# EAGLE design Voicecard-SVF-v04 (EAGLE 5.09)
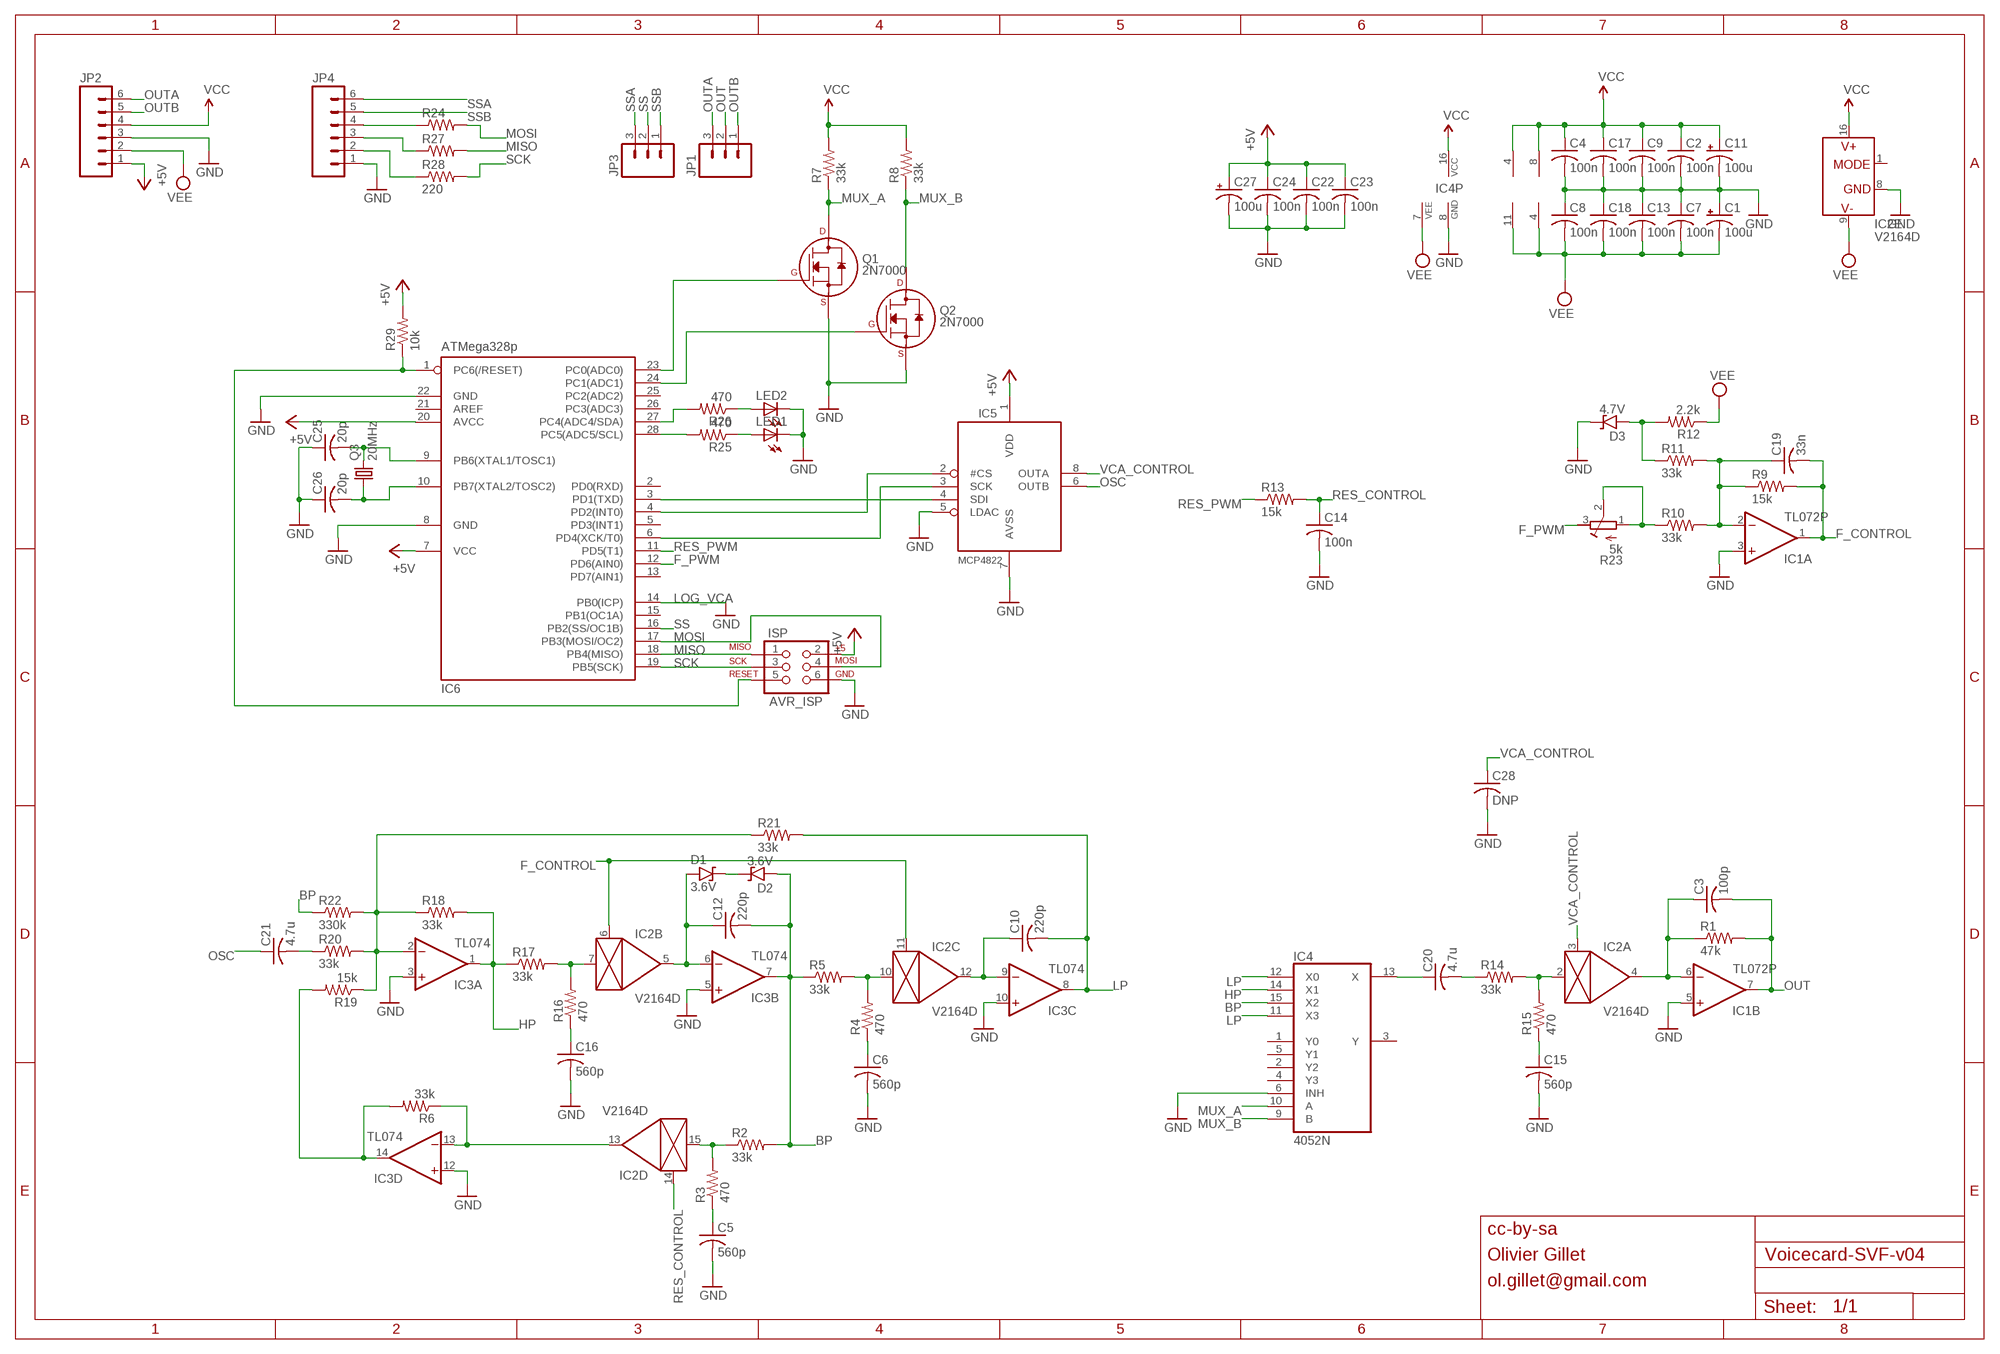
[diagram p0: schematic, sheet 1]

## Parts
C1  100u  CPOL-USE2.5-6  [E2,5-6]
C2  100n  C-US025-025X050  [C025-025X050]
C3  100p  C-US025-025X050  [C025-025X050]
C4  100n  C-US025-025X050  [C025-025X050]
C5  560p  C-US025-025X050  [C025-025X050]
C6  560p  C-US025-025X050  [C025-025X050]
C7  100n  C-US025-025X050  [C025-025X050]
C8  100n  C-US025-025X050  [C025-025X050]
C9  100n  C-US025-025X050  [C025-025X050]
C10  220p  C-US025-025X050  [C025-025X050]
C11  100u  CPOL-USE2.5-6  [E2,5-6]
C12  220p  C-US025-025X050  [C025-025X050]
C13  100n  C-US025-025X050  [C025-025X050]
C14  100n  C-US025-025X050  [C025-025X050]
C15  560p  C-US025-025X050  [C025-025X050]
C16  560p  C-US025-025X050  [C025-025X050]
C17  100n  C-US025-025X050  [C025-025X050]
C18  100n  C-US025-025X050  [C025-025X050]
C19  33n  C-US050-025X075  [C050-025X075]
C20  4.7u  C-US  [ENP11-6.3]
C21  4.7u  C-US  [ENP11-6.3]
C22  100n  C-US025-025X050  [C025-025X050]
C23  100n  C-US025-025X050  [C025-025X050]
C24  100n  C-US025-024X044  [C025-024X044]
C25  20p  C-US025-024X044  [C025-024X044]
C26  20p  C-US025-024X044  [C025-024X044]
C27  100u  CPOL-USE2.5-6  [E2,5-6]
C28  DNP  C-US025-025X050  [C025-025X050]
D1  3.6V  1N47XXDO35  [D-5]
D2  3.6V  1N47XXDO35  [D-5]
D3  4.7V  1N47XXDO35  [D-5]
IC1  TL072P  [DIL08]
IC2  V2164D  SSM2164P  [DIL16]
IC3  TL074  TL084P  [DIL14]
IC4  4052N  [DIL16]
IC5  MCP4822  [DIL08]
IC6  ATMega328p  MEGA8-P  [DIL28-3]
ISP  AVR_ISP  AVR_SPI_PRG_6PTH  [2X3]
JP1  M03PTH  [1X03]
JP2  M06SIP  [1X06]
JP3  M03PTH  [1X03]
JP4  M06SIP  [1X06]
LED1  LED3MM  [LED3MM]
LED2  LED3MM  [LED3MM]
Q1  2N7000  [TO-92]
Q2  2N7000  [TO-92]
Q3  20MHz  CRYSTALHC49U-V  [HC49U-V]
R1  47k  R-US_0204/7  [0204/7]
R2  33k  R-US_0204/7  [0204/7]
R3  470  R-US_0204/7  [0204/7]
R4  470  R-US_0204/7  [0204/7]
R5  33k  R-US_0204/7  [0204/7]
R6  33k  R-US_0204/7  [0204/7]
R7  33k  R-US_0204/7  [0204/7]
R8  33k  R-US_0204/7  [0204/7]
R9  15k  R-US_0204/7  [0204/7]
R10  33k  R-US_0204/7  [0204/7]
R11  33k  R-US_0204/7  [0204/7]
R12  2.2k  R-US_0204/7  [0204/7]
R13  15k  R-US_0204/7  [0204/7]
R14  33k  R-US_0204/7  [0204/7]
R15  470  R-US_0204/7  [0204/7]
R16  470  R-US_0204/7  [0204/7]
R17  33k  R-US_0204/7  [0204/7]
R18  33k  R-US_0204/7  [0204/7]
R19  15k  R-US_0204/7  [0204/7]
R20  33k  R-US_0204/7  [0204/7]
R21  33k  R-US_0204/7  [0204/7]
R22  330k  R-US_0204/7  [0204/7]
R23  5k  R-TRIMM3296P  [RTRIM3296P]
R24  220  R-US_0204/7  [0204/7]
R25  470  R-US_0204/7  [0204/7]
R26  470  R-US_0204/7  [0204/7]
R27  220  R-US_0204/7  [0204/7]
R28  220  R-US_0204/7  [0204/7]
R29  10k  R-US_0204/7  [0204/7]

## Nets
+5V: C22.1 C23.1 C24.1 C27.+ IC5.1(VDD) IC6.7(VCC) IC6.20(AVCC) ISP.2 JP2.1 R29.2
BP: C12.2 D2.A IC3.7(B:OUT) IC4.15(X2) R2.2 R5.1 R22.1
F_CONTROL: C19.2 IC1.1(A:OUT) IC2.6(B:CTRL) IC2.11(C:CTRL) R9.2
F_PWM: IC6.12(PD6(AIN0)) R23.3(A)
FILTER_MIX1: C20.+ IC4.13(X)
GND: C1.+ C2.2 C4.2 C5.2 C6.2 C7.1 C8.1 C9.2 C11.- C13.1 C14.2 C15.2 C16.2 C17.2 C18.1 C22.2 C23.2 C24.2 C25.1 C26.1 C27.- C28.2 D3.C IC1.3(A:+IN) IC1.5(B:+IN) IC2.8(E:GND) IC3.3(A:+IN) IC3.5(B:+IN) IC3.10(C:+IN) IC3.12(D:+IN) IC4.6(INH) IC4.8(GND) IC5.5(LDAC) IC5.7(AVSS) IC6.8(GND) IC6.14(PB0(ICP)) IC6.22(GND) ISP.6 JP2.3 JP4.1 LED1.K(C) LED2.K(C) Q1.1(S) Q2.1(S)
HP: IC3.1(A:OUT) IC4.14(X1) R17.1 R18.2
LEDS0: IC6.28(PC5(ADC5/SCL)) R25.2
LP: C10.2 IC3.8(C:OUT) IC4.11(X3) IC4.12(X0) R21.2
MISO: IC6.18(PB4(MISO)) ISP.1 R27.2
MOSI: IC6.17(PB3(MOSI/OC2)) ISP.4 R24.2
MUX_A: IC4.10(A) Q1.3(D) R7.1
MUX_B: IC4.9(B) Q2.3(D) R8.1
N$1: C21.- R20.1
N$3: IC5.4(SDI) IC6.3(PD1(TXD))
N$4: IC6.23(PC0(ADC0)) Q1.2(G)
N$5: C20.- R14.1
N$6: IC6.24(PC1(ADC1)) Q2.2(G)
N$7: LED1.A R25.1
N$8: JP4.2 R28.1
N$9: D3.A R11.1 R12.2
N$10: LED2.A R26.1
N$11: IC6.27(PC4(ADC4/SDA)) R26.2
N$12: IC3.2(A:-IN) R18.1 R19.1 R20.2 R21.1 R22.2
N$13: JP4.3 R27.1
N$14: IC6.1(PC6(/RESET)) ISP.5 R29.1
N$15: IC5.3(SCK) IC6.6(PD4(XCK/T0))
N$16: IC5.2(#CS) IC6.4(PD2(INT0))
N$17: C6.1 R4.1
N$18: JP4.4 R24.1
N$19: C12.1 D1.A IC2.5(B:OUT) IC3.6(B:-IN)
N$21: IC2.15(D:IN) R2.1 R3.2
N$26: IC2.10(C:IN) R4.2 R5.2
N$27: C5.1 R3.1
N$28: C10.1 IC2.12(C:OUT) IC3.9(C:-IN)
N$29: IC2.7(B:IN) R16.2 R17.2
N$30: C16.1 R16.1
N$31: IC2.13(D:OUT) IC3.13(D:-IN) R6.1
N$40: C19.1 IC1.2(A:-IN) R9.1 R10.2 R11.2
N$41: R10.1 R23.1(E) R23.2(S)
N$48: IC3.14(D:OUT) R6.2 R19.2
N$55: D1.C D2.C
N$65: C15.1 R15.1
N$67: IC2.2(A:IN) R14.2 R15.2
N$77: C3.1 IC1.6(B:-IN) IC2.4(A:OUT) R1.1
N$82: C26.2 IC6.10(PB7(XTAL2/TOSC2)) Q3.1
N$83: C25.2 IC6.9(PB6(XTAL1/TOSC1)) Q3.2
OSC: C21.+ IC5.6(OUTB)
OUT: C3.2 IC1.7(B:OUT) JP1.2 R1.2
OUTA: JP1.3 JP2.6
OUTB: JP1.1 JP2.5
RES_CONTROL: C14.1 IC2.14(D:CTRL) R13.2
RES_PWM: IC6.11(PD5(T1)) R13.1
SCK: IC6.19(PB5(SCK)) ISP.3 R28.2
SS: IC6.16(PB2(SS/OC1B)) JP3.2
SSA: JP3.3 JP4.6
SSB: JP3.1 JP4.5
VCA_CONTROL: C28.1 IC2.3(A:CTRL) IC5.8(OUTA)
VCC: C2.1 C4.1 C9.1 C11.+ C17.1 IC1.8(P:V+) IC2.16(E:V+) IC3.4(P:V+) IC4.16(VCC) JP2.4 R7.2 R8.2
VEE: C1.- C7.2 C8.2 C13.2 C18.2 IC1.4(P:V-) IC2.9(E:V-) IC3.11(P:V-) IC4.7(VEE) JP2.2 R12.1
Unconnected: IC2.1(E:MODE) IC4.1(Y0) IC4.2(Y2) IC4.3(Y) IC4.4(Y3) IC4.5(Y1) IC6.2(PD0(RXD)) IC6.5(PD3(INT1)) IC6.13(PD7(AIN1)) IC6.15(PB1(OC1A)) IC6.21(AREF) IC6.25(PC2(ADC2)) IC6.26(PC3(ADC3))

## Notes on the sheet
- LOG_VCA
- cc-by-sa
- Olivier Gillet
- ol.gillet@gmail.com

## Library data of the parts
C1 C11 C27 = rcl:CPOL-US: POLARIZED CAPACITOR, American symbol
C2-C10 C12-C19 C22-C26 C28 = rcl:C-US: CAPACITOR, American symbol
C20 C21 = og-rcl:C-US
D1-D3 = og-diodes:1N47XX: Zener Diode 1N4728 - 1N4764: 3.3 V - 100V, 10% (1n47xxA 5%); DO-41 glass case
IC1 = linear:TL072: OP AMP
IC2 = ssm2164:SSM2164
IC3 = linear:TL084: OP AMP
IC4 = 40xx:4052: Dual 4-channel ANALOG MULTIPLEXER
IC5 = og-dac:MCP4822
IC6 = atmel:MEGA8-P: MICROCONTROLLER 8 Kbytes FLASH, 1 kbytes SRAM, 512 bytes EEPROM, USART, 4-channel 10 bit ADC, 2-channel 8 bit ADC Pin compatible with Atmega48, ATMega88, ATMega168 Source: avr.lbr
ISP = SparkFun:AVR_SPI_PRG_6: AVR ISP 6 Pin This is the reduced ISP connector for AVR programming. Common on Arduino. This footprint will take up less PCB space and can be used with a 10-pin to 6-pin adapter such as SKU: BOB-08508
JP1 JP3 = SparkFun:M03: Header 3 Standard 3-pin 0.1" header. Use with straight break away headers (SKU : PRT-00116), right angle break away headers (PRT-00553), swiss pins (PRT-00743), machine pins (PRT-00117), and female headers (PRT-00115). Molex polarized connector foot print use with SKU : PRT-08232 with associated crimp pins and housings.
JP2 JP4 = SparkFun:M06: Header 6 Standard 6-pin 0.1" header. Use with straight break away headers (SKU : PRT-00116), right angle break away headers (PRT-00553), swiss pins (PRT-00743), machine pins (PRT-00117), and female headers (PRT-00115). Molex polarized connector foot print use with SKU : PRT-08094 with associated crimp pins and housings. NOTES ON THE VARIANTS LOCK and LOCK_LONGPADS... This footprint was designed to help hold the alignment of a through-hole component (i.e. 6-pin header) while soldering it into place. You may notice that each hole has been shifted either up or down by 0.005 of an inch from it's more standard position (which is a perfectly straight line). This slight alteration caused the pins (the squares in the middle) to touch the edges of the holes. Because they are alternating, it causes a "brace" to hold the component in place. 0.005 has proven to be the perfect amount of "off-center" position when using our standard breakaway headers. Although looks a little odd when you look at the bare footprint, once you have a header in there, the alteration is very hard to notice. Also, if you push a header all the way into place, it is covered up entirely on the bottom side. This idea of altering the position of holes to aid alignment will be further integrated into the Sparkfun Library for other footprints. It can help hold any component with 3 or more connection pins.
LED1 LED2 = led:LED: LED OSRAM: - CHIPLED LG R971, LG N971, LY N971, LG Q971, LY Q971, LO R971, LY R971 LH N974, LH R974 LS Q976, LO Q976, LY Q976 LO Q996 - Hyper CHIPLED LW Q18S LB Q993, LB Q99A, LB R99A - SideLED LS A670, LO A670, LY A670, LG A670, LP A670 LB A673, LV A673, LT A673, LW A673 LH A674 LY A675 LS A676, LA A676, LO A676, LY A676, LW A676 LS A679, LY A679, LG A679 - Hyper Micro SIDELED® LS Y876, LA Y876, LO Y876, LY Y876 LT Y87S - SmartLED LW L88C, LW L88S LB L89C, LB L89S, LG L890 LS L89K, LO L89K, LY L89K LS L896, LA L896, LO L896, LY L896 - TOPLED LS T670, LO T670, LY T670, LG T670, LP T670 LSG T670, LSP T670, LSY T670, LOP T670, LYG T670 LG T671, LOG T671, LSG T671 LB T673, LV T673, LT T673, LW T673 LH T674 LS T676, LA T676, LO T676, LY T676, LB T676, LH T676, LSB T676, LW T676 LB T67C, LV T67C, LT T67C, LS T67K, LO T67K, LY T67K, LW E67C LS E67B, LA E67B, LO E67B, LY E67B, LB E67C, LV E67C, LT E67C LW T67C LS T679, LY T679, LG T679 LS T770, LO T770, LY T770, LG T770, LP T770 LB T773, LV T773, LT T773, LW T773 LH T774 LS E675, LA E675, LY E675, LS T675 LS T776, LA T776, LO T776, LY T776, LB T776 LHGB T686 LT T68C, LB T68C - Hyper Mini TOPLED® LB M676 - Mini TOPLED Santana® LG M470 LS M47K, LO M47K, LY M47K Source: http://www.osram.convergy.de LUXEON: - LUMILED® LXK2-PW12-R00, LXK2-PW12-S00, LXK2-PW14-U00, LXK2-PW14-V00 LXK2-PM12-R00, LXK2-PM12-S00, LXK2-PM14-U00 LXK2-PE12-Q00, LXK2-PE12-R00, LXK2-PE12-S00, LXK2-PE14-T00, LXK2-PE14-U00 LXK2-PB12-K00, LXK2-PB12-L00, LXK2-PB12-M00, LXK2-PB14-N00, LXK2-PB14-P00, LXK2-PB14-Q00 LXK2-PR12-L00, LXK2-PR12-M00, LXK2-PR14-Q00, LXK2-PR14-R00 LXK2-PD12-Q00, LXK2-PD12-R00, LXK2-PD12-S00 LXK2-PH12-R00, LXK2-PH12-S00 LXK2-PL12-P00, LXK2-PL12-Q00, LXK2-PL12-R00 Source: www.luxeon.com KINGBRIGHT: KA-3528ASYC Source: www.kingbright.com
Q1 Q2 = og-transistors:2N7000: N-channel MOSFET
Q3 = crystal:CRYSTAL: CRYSTAL
R1-R22 R24-R29 = rcl:R-US_: RESISTOR, American symbol
R23 = rcl:R-TRIMM: Trimm resistor

## Board
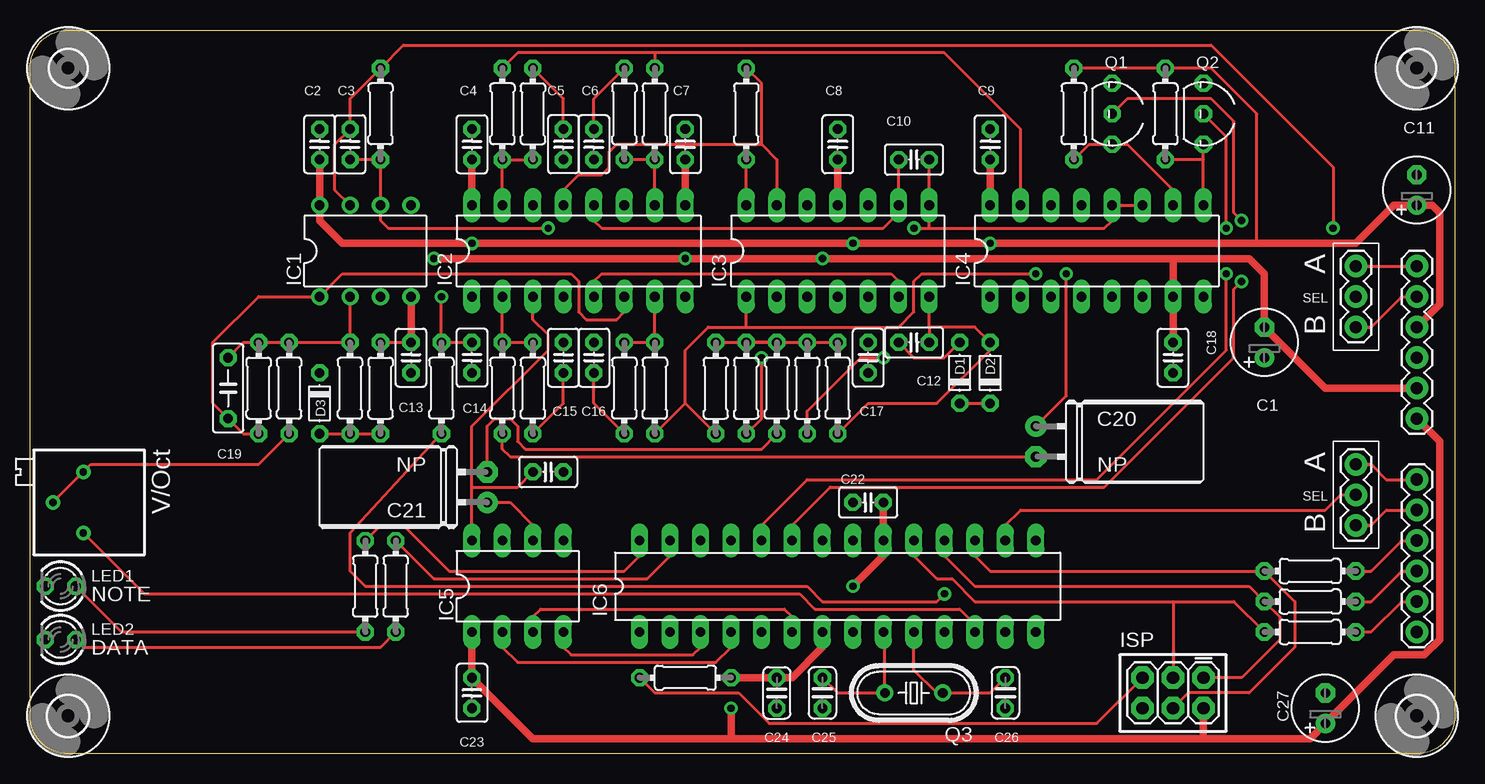
[diagram p1: board, top side]
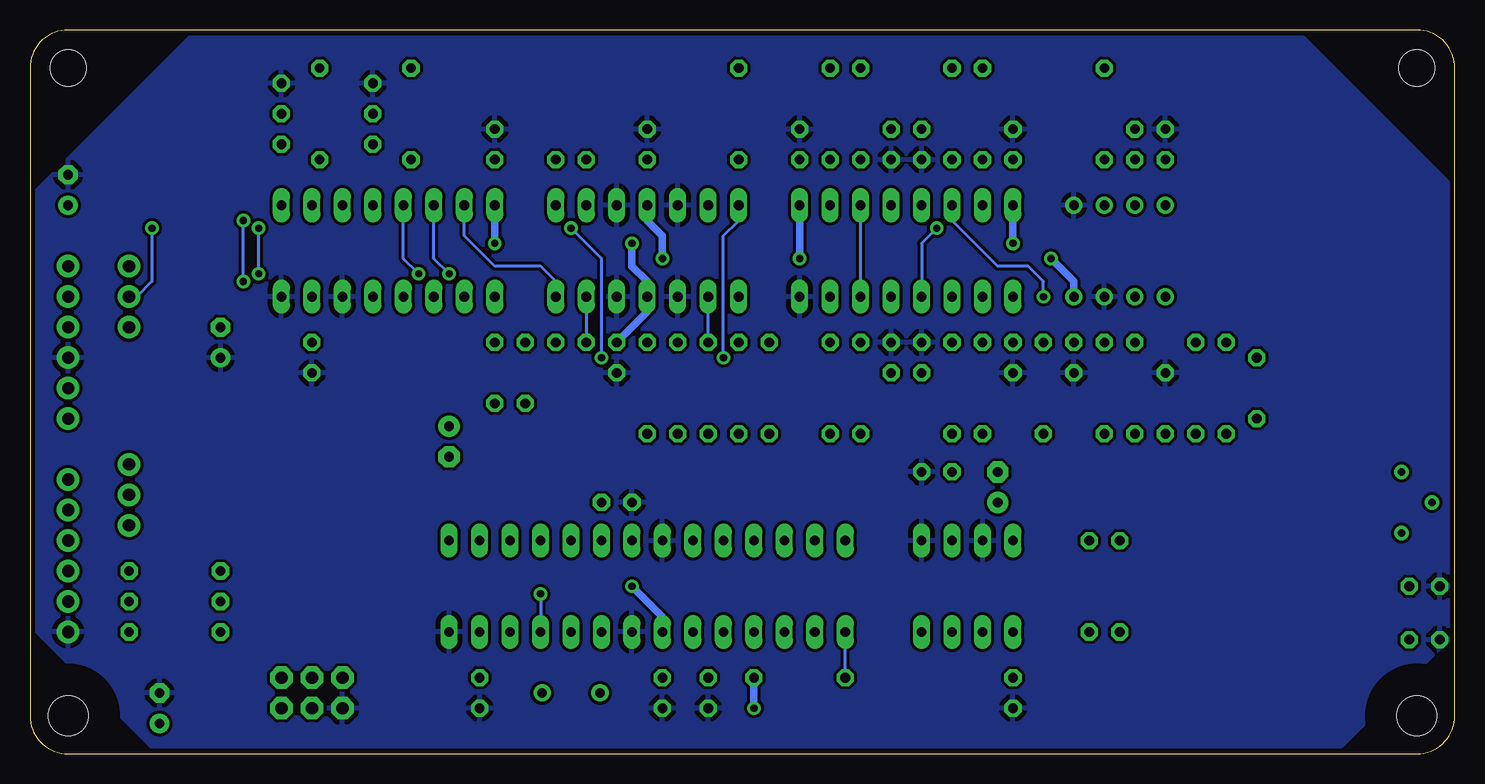
[diagram p2: board, bottom side, seen from below]

Size 118.75 x 60.33 mm. Coordinates in mm from the lower left corner, seen from the top.
Outline: 0,57.15 arc-90 3.17,60.33 115.57,60.33 arc-90 118.75,57.15 118.75,3.17 arc-90 115.57,0 3.17,0 arc-90 0,3.17 0,57.15
Copper layers (1*16): Top 0.035mm / dielectric 1.5mm / Bottom 0.035mm
Design rules "SparkFun *": minimum track width 8mil, minimum drill 20mil, track to track 8mil, track to pad 8mil, pad to pad 8mil, via to via 8mil, smd to smd 8mil, copper to edge 10mil, drill to drill 8mil, minimum pad ring 12mil, minimum via ring 10mil, stop-mask expansion 4mil, vias tented up to drill 25mil, thermal gap 16mil

### Footprints (pad centres in the part's own frame; a part is rotated, then mirrored left to right if it is on the bottom)
E2,5-6 = drill 0.813 pad 1.6 round: + -1.27,0 | drill 0.813 pad 1.6 octagon: - 1.27,0
C025-025X050 = drill 0.813 octagon: 1 -1.27,0; 2 1.27,0
C050-025X075 = drill 0.813 octagon: 1 -2.54,0; 2 2.54,0
ENP11-6.3 = drill 0.813 pad 1.778 round: + -2.54,1.27 | drill 0.813 pad 1.778 octagon: - -2.54,-1.27
C025-024X044 = drill 0.813 octagon: 1 -1.27,0; 2 1.27,0
D-5 = drill 0.813 octagon: A 2.54,0; C -2.54,0
DIL08 = drill 0.813 pad 1.27 round: 1 -3.81,-3.81; 2 -1.27,-3.81; 3 1.27,-3.81; 4 3.81,-3.81; 5 3.81,3.81; 6 1.27,3.81; 7 -1.27,3.81; 8 -3.81,3.81
DIL16 = drill 0.813 long: 1 -8.89,-3.81; 2 -6.35,-3.81; 3 -3.81,-3.81; 4 -1.27,-3.81; 5 1.27,-3.81; 6 3.81,-3.81; 7 6.35,-3.81; 8 8.89,-3.81; 9 8.89,3.81; 10 6.35,3.81; 11 3.81,3.81; 12 1.27,3.81; 13 -1.27,3.81; 14 -3.81,3.81; 15 -6.35,3.81; 16 -8.89,3.81
DIL14 = drill 0.813 long: 1 -7.62,-3.81; 2 -5.08,-3.81; 3 -2.54,-3.81; 4 0,-3.81; 5 2.54,-3.81; 6 5.08,-3.81; 7 7.62,-3.81; 8 7.62,3.81; 9 5.08,3.81; 10 2.54,3.81; 11 0,3.81; 12 -2.54,3.81; 13 -5.08,3.81; 14 -7.62,3.81
DIL08' = drill 0.813 long: 1 -3.81,-3.81; 2 -1.27,-3.81; 3 1.27,-3.81; 4 3.81,-3.81; 5 3.81,3.81; 6 1.27,3.81; 7 -1.27,3.81; 8 -3.81,3.81
DIL28-3 = drill 0.813 long: 1 -16.51,-3.81; 2 -13.97,-3.81; 3 -11.43,-3.81; 4 -8.89,-3.81; 5 -6.35,-3.81; 6 -3.81,-3.81; 7 -1.27,-3.81; 8 1.27,-3.81; 9 3.81,-3.81; 10 6.35,-3.81; 11 8.89,-3.81; 12 11.43,-3.81; 13 13.97,-3.81; 14 16.51,-3.81; 15 16.51,3.81; 16 13.97,3.81; 17 11.43,3.81; 18 8.89,3.81; 19 6.35,3.81; 20 3.81,3.81; 21 1.27,3.81; 22 -1.27,3.81; 23 -3.81,3.81; 24 -6.35,3.81; 25 -8.89,3.81; 26 -11.43,3.81; 27 -13.97,3.81; 28 -16.51,3.81
2X3 = drill 1.016 pad 1.88 octagon: 1 0,0; 2 0,2.54; 3 2.54,0; 4 2.54,2.54; 5 5.08,0; 6 5.08,2.54
1X03 = drill 1.016 pad 1.88 round: 1 0,0; 2 2.54,0; 3 5.08,0
1X06 = drill 1.016 pad 1.88 round: 1 0,0; 2 2.54,0; 3 5.08,0; 4 7.62,0; 5 10.16,0; 6 12.7,0
LED3MM = drill 0.813 octagon: A -1.27,0; K 1.27,0
TO-92 = drill 0.813 octagon: 1 -2.54,0; 2 0,0; 3 2.54,0
HC49U-V = drill 0.813 round: 1 -2.413,0; 2 2.413,0
0204/7 = drill 0.813 octagon: 1 -3.81,0; 2 3.81,0
RTRIM3296P = drill 0.61 round: 1 0,-2.54; 2 2.54,0; 3 0,2.54
3,0 = hole 3: 0,0
3,3 = hole 3.3: 0,0

### Placement (x,y rotation side)
C1  102.87,34.29 90 top
C2  24.13,50.8 90 top
C3  26.67,50.8 90 top
C4  36.83,50.8 90 top
C5  44.45,50.8 270 top
C6  46.99,50.8 270 top
C7  54.61,50.8 270 top
C8  67.31,50.8 270 top
C9  80.01,50.8 90 top
C10  73.66,49.53 0 top
C11  115.57,46.99 90 top
C12  73.66,34.29 0 top
C13  31.75,33.02 90 top
C14  36.83,33.02 270 top
C15  44.45,33.02 90 top
C16  46.99,33.02 90 top
C17  69.85,33.02 270 top
C18  95.25,33.02 90 top
C19  16.51,30.48 270 top
C20  86.36,26.04 0 top
C21  35.56,22.22 180 top
C22  69.85,20.95 180 top
C23  36.83,5.08 270 top
C24  62.23,5.08 270 top
C25  66.04,5.08 90 top
C26  81.28,5.08 90 top
C27  107.95,3.81 90 top
C28  43.18,23.5 0 top
D1  77.47,31.75 90 top
D2  80.01,31.75 90 top
D3  24.13,29.21 270 top
IC1  27.94,41.91 0 top
IC2  45.72,41.91 0 top
IC3  67.31,41.91 0 top
IC4  88.9,41.91 0 top
IC5  MCP4822  [DIL08']  40.64,13.97 0 top
IC6  67.31,13.97 0 top
ISP  97.79,6.35 180 top
JP1  110.49,35.56 90 top
JP2  115.57,27.94 90 top
JP3  110.49,19.05 90 top
JP4  115.57,10.16 90 top
LED1  2.54,13.97 180 top
LED2  2.54,9.53 180 top
Q1  90.17,53.34 270 top
Q2  97.79,53.34 270 top
Q3  73.66,5.08 180 top
R1  29.21,53.34 90 top
R2  39.37,53.34 90 top
R3  41.91,53.34 270 top
R4  49.53,53.34 270 top
R5  52.07,53.34 270 top
R6  59.69,53.34 270 top
R7  87,53.34 90 top
R8  94.61,53.34 90 top
R9  19.05,30.48 270 top
R10  21.59,30.48 90 top
R11  26.67,30.48 90 top
R12  29.21,30.48 270 top
R13  34.29,30.48 90 top
R14  39.37,30.48 90 top
R15  41.91,30.48 90 top
R16  49.53,30.48 90 top
R17  52.07,30.48 90 top
R18  57.15,30.48 270 top
R19  59.69,30.48 270 top
R20  62.23,30.48 90 top
R21  64.77,30.48 270 top
R22  67.31,30.48 90 top
R23  4.45,20.95 180 top
R24  106.68,15.24 180 top
R25  27.94,13.97 90 top
R26  30.48,13.97 90 top
R27  106.68,12.7 180 top
R28  106.68,10.16 180 top
R29  54.61,6.35 0 top
U$1  [3,0]  3.17,57.15 0 top
U$2  [3,0]  115.57,57.15 0 top
U$3  [LAPINO_LARGE]  3.17,28.57 0 top
U$4  [SARASWATI]  10.16,6.35 0 top
U$5  [3,3]  3.17,3.17 0 top
U$6  [3,3]  115.57,3.17 0 top

### Tracks (layer width: path | path; a pad name or v marks a point on that pad's centre or on a via)
+5V  (via drill 0.6)
  Top 0.61: v68.58,13.97 71.12,16.51 IC6.20 C22.1 | 58.42,1.27 41.91,1.27 C23.1 IC5.1 | 58.42,1.27 97.79,1.27 | 97.79,1.27 106.68,1.27 C27.+ 113.67,8.26 116.2,8.26 117.47,9.53 117.47,26.04 JP2.1 | R29.2 C24.1 63.5,6.35 66.04,8.89 IC6.7 | 58.42,1.27 v58.42,3.81 | 97.79,1.27 ISP.2
  Bottom 0.61: v68.58,13.97 66.04,11.43 IC6.7 | v58.42,3.81 R29.2
BP
  Top 0.254: R2.2 40.64,58.42 52.07,58.42 | 74.93,35.56 IC3.7 | 74.93,35.56 C12.2 | 52.07,58.42 76.2,58.42 82.55,52.07 IC4.15 | 52.07,58.42 R5.1 | 74.93,35.56 78.74,35.56 D2.A 80.01,33.66 75.56,29.21 69.85,29.21 R22.1
  Bottom 0.254: IC4.15 82.55,43.18 80.01,40.64 76.2,40.64 74.93,39.37 IC3.7
F_CONTROL
  Top 0.254: R9.2 17.78,26.67 C19.2 15.24,29.21 15.24,34.29 19.05,38.1 IC1.1 26.04,40.01 45.09,40.01 45.72,39.37 45.72,36.83 46.35,36.2 48.9,36.2 49.53,36.83 IC2.6
  Bottom 0.254: IC2.6 IC2.11
F_PWM
  Top 0.254: IC6.12 78.74,10.79 77.47,12.06 65.41,12.06 64.14,13.33 9.53,13.33 R23.3
FILTER_MIX1  (via drill 0.6)
  Top 0.254: C20.+ 86.36,29.84 v86.36,40.01
  Bottom 0.254: v86.36,40.01 87.63,41.28 IC4.13
GND
  pour Bottom (isolate 0.254): 0.64,47.62 0.64,9.53 9.53,0.64 108.58,0.64 118.11,10.16 118.11,46.99 105.41,59.69 12.7,59.69
HP  (via drill 0.6)
  Top 0.254: v83.82,40.01 74.3,40.01 73.66,39.37 73.66,36.83 72.39,35.56 59.69,35.56 | R17.1 54.61,29.21 | 54.61,29.21 R18.2 | 59.69,35.56 IC3.1 | 59.69,35.56 56.52,35.56 54.61,33.66 54.61,29.21
  Bottom 0.254: v83.82,40.01 85.09,41.28 IC4.14
LEDS0
  Top 0.254: R25.2 29.21,19.05 31.11,19.05 34.92,15.24 49.53,15.24 50.8,16.51 IC6.28
LP  (via drill 0.6)
  Top 0.254: C10.2 IC3.8 74.93,43.82 | v73.66,43.82 74.93,43.82 | 74.93,43.82 89.53,43.82 90.17,44.45 IC4.12 IC4.11 | R21.2 64.77,28.57 69.22,33.02 v71.12,33.02
  Bottom 0.254: v71.12,33.02 71.12,41.28 v73.66,43.82
MISO
  Top 0.254: IC6.18 76.2,16.51 78.74,13.97 101.6,13.97 R27.2 104.14,11.43 104.14,9.53 100.97,6.35 ISP.1
MOSI
  Top 0.254: IC6.17 78.74,16.51 80.01,15.24 R24.2 105.41,12.7 105.41,8.89 101.6,5.08 96.52,5.08 ISP.4
MUX_A
  Top 0.254: IC4.10 95.25,46.99 91.44,50.8 Q1.3 88.27,50.8 R7.1
MUX_B
  Top 0.254: IC4.9 97.79,49.53 | 97.79,49.53 Q2.3 | 97.79,49.53 R8.1
N$1
  Top 0.254: R20.1 60.96,25.4 41.27,25.4 40.64,26.04 40.64,27.3 40.01,27.94 38.73,27.94 38.1,27.3 C21.-
N$3
  Top 0.254: IC6.3 55.88,8.89 55.24,8.26 45.09,8.26 44.45,8.89 IC5.4
N$4  (via drill 0.6)
  Top 0.254: Q1.2 91.44,54.61 98.42,54.61 100.33,52.71 100.33,45.09 v100.97,44.45 | v100.97,39.37 100.33,38.74 100.33,33.02 89.53,22.22 66.67,22.22 63.5,19.05 IC6.23
  Bottom 0.254: v100.97,39.37 v100.97,44.45
N$5
  Top 0.254: R14.1 39.37,25.4 40.01,24.77 C20.-
N$6  (via drill 0.6)
  Top 0.254: Q2.2 99.69,51.44 v99.69,43.82 | v99.69,40.01 99.69,33.66 88.9,22.86 64.77,22.86 60.96,19.05 IC6.24
  Bottom 0.254: v99.69,40.01 v99.69,43.82
N$7
  Top 0.254: R25.1 7.62,10.16 LED1.A
N$8
  Top 0.254: R28.1 111.76,10.16 114.3,12.7 JP4.2
N$9
  Top 0.254: R12.2 R11.1 D3.A
N$10
  Top 0.254: R26.1 29.21,8.89 4.45,8.89 LED2.A
N$11
  Top 0.254: R26.2 33.66,14.61 51.44,14.61 53.34,16.51 IC6.27
N$12
  Top 0.254: R18.1 R20.2 R19.1 R21.1 R22.2
  Bottom 0.254: R20.2 IC3.2
N$13
  Top 0.254: R27.1 111.76,12.7 114.3,15.24 JP4.3
N$14
  Top 0.254: R29.1 52.07,5.08 59.05,5.08 61.59,2.54 62.23,2.54 88.9,2.54 ISP.5
  Bottom 0.254: R29.1 IC6.1
N$15
  Top 0.254: IC6.6 63.5,11.43 62.87,12.06 42.55,12.06 41.91,11.43 IC5.3
N$16
  Top 0.254: IC6.4 58.42,8.89 57.15,7.62 40.64,7.62 39.37,8.89 IC5.2
N$17
  Top 0.254: R4.1 46.99,54.61 C6.1
N$18
  Top 0.254: R24.1 111.76,15.24 114.3,17.78 JP4.4
N$19
  Top 0.254: IC2.5 46.99,39.37 47.62,40.01 71.75,40.01 72.39,39.37 IC3.6 | C12.1 73.66,33.02 76.2,33.02 D1.A
  Bottom 0.254: IC3.6 C12.1
N$21
  Top 0.254: R3.2 R2.1 IC2.15
N$26
  Top 0.254: R4.2 R5.2 IC2.10
N$27
  Top 0.254: R3.1 44.45,54.61 C5.1
N$28
  Top 0.254: C10.1 IC3.9 72.39,45.09 71.12,43.82 47.62,43.82 46.99,44.45 IC2.12
N$29
  Top 0.254: R16.2 R17.2 IC2.7
N$30
  Top 0.254: C16.1 46.99,29.21 R16.1
N$31
  Top 0.254: R6.1 60.96,55.88 60.96,50.8 | 60.96,50.8 62.23,49.53 IC3.13 | 60.96,50.8 48.9,50.8 48.26,50.17 48.26,48.9 47.62,48.26 45.72,48.26 44.45,46.99 IC2.13
N$40
  Top 0.254: C19.1 17.78,34.29 R9.1 R10.2 R11.2 IC1.2
N$41
  Top 0.254: R23.2 R23.1 5.08,24.13 19.05,24.13 R10.1
N$48  (via drill 0.6)
  Top 0.254: IC3.14 R6.2 | v60.96,33.02 60.96,27.94 R19.2
  Bottom 0.254: IC3.14 59.69,44.45 60.96,43.18 v60.96,33.02
N$55
  Top 0.254: D1.C D2.C
N$65
  Top 0.254: C15.1 44.45,29.21 R15.1
N$67
  Top 0.254: R15.2 R14.2 IC2.2
N$77  (via drill 0.6)
  Top 0.254: C3.1 R1.1 IC1.6 29.21,44.45 29.84,43.82 v43.18,43.82
  Bottom 0.254: IC2.4 44.45,42.55 v43.18,43.82
N$82
  Top 0.254: IC6.10 73.66,6.98 75.56,5.08 Q3.1 80.01,5.08 C26.2
N$83
  Top 0.254: IC6.9 71.25,10.03 Q3.2 67.31,5.08 C25.2
OSC
  Top 0.254: C21.+ 40.01,20.95 41.91,19.05 IC5.6
OUT  (via drill 0.6)
  Top 0.254: IC1.7 25.4,46.99 25.4,50.8 C3.2 26.67,54.61 R1.2 31.11,59.05 98.42,59.05 108.58,48.9 v108.58,43.82
  Bottom 0.254: v108.58,43.82 108.58,39.37 109.86,38.1 JP1.2
OUTA
  Top 0.254: JP1.3 JP2.6
OUTB
  Top 0.254: JP1.1 111.76,35.56 114.3,38.1 JP2.5
RES_CONTROL  (via drill 0.6)
  Top 0.254: C14.1 R13.2 v34.29,38.1
  Bottom 0.254: v34.29,38.1 34.29,39.37 35.56,40.64 38.1,40.64 41.91,44.45 IC2.14
RES_PWM  (via drill 0.6)
  Top 0.254: v76.2,13.33 75.56,12.7 66.04,12.7 64.77,13.97 27.94,13.97 26.67,15.24 26.67,18.41 R13.1
  Bottom 0.254: v76.2,13.33 IC6.11
SCK
  Top 0.254: IC6.19 73.66,16.51 75.56,14.61 76.83,14.61 78.74,12.7 95.25,12.7 | 95.25,12.7 100.33,12.7 R28.2 | 95.25,12.7 ISP.3
SS
  Top 0.254: JP3.2 109.22,21.59 107.95,20.32 82.55,20.32 81.28,19.05 IC6.16
SSA
  Top 0.254: JP3.3 111.76,24.13 113.03,22.86 JP4.6
SSB
  Top 0.254: JP3.1 111.76,19.05 113.03,20.32 JP4.5
VCA_CONTROL
  Top 0.254: IC5.8 36.83,22.22 | 36.83,22.22 36.83,27.3 43.18,33.66 43.18,34.93 41.91,36.2 IC2.3 | C28.1 40.64,22.22 36.83,22.22
VCC  (via drill 0.6)
  Top 0.254: 102.23,42.55 102.23,53.34 98.42,57.15 R8.2 R7.2
  Top 0.61: JP2.4 117.47,37.47 117.47,45.09 116.84,45.72 C11.+ 113.67,45.72 110.49,42.55 102.23,42.55 v80.01,42.55 v68.58,42.55 v36.83,42.55 26.04,42.55 24.13,44.45 IC1.8 C2.1 | IC4.16 C9.1 | IC2.16 C4.1
  Bottom 0.61: v36.83,42.55 IC2.16 | v68.58,42.55 68.58,40.64 67.31,39.37 IC3.4 67.31,36.83 C17.1 | v80.01,42.55 IC4.16
VEE  (via drill 0.6)
  Top 0.254: R12.1 C13.2
  Top 0.61: v33.66,41.28 v54.61,41.28 v66.04,41.28 95.25,41.28 | 95.25,41.28 IC4.7 C18.2 | IC3.11 C8.2 | IC2.9 C7.2 | C13.2 IC1.4 | 95.25,41.28 101.6,41.28 102.87,40.01 C1.- 107.95,30.48 JP2.2
  Bottom 0.61: v54.61,41.28 IC2.9 | IC3.11 67.31,44.45 66.04,43.18 v66.04,41.28 | v33.66,41.28 31.75,39.37 IC1.4

### Text on the board
tPlace: V/Oct
tNames: A | SEL | B | A | SEL | B | NOTE | DATA
tValues: Z4.7V | Z3.6V
200bmp: cc-by-sa | Mutable Instruments | Olivier Gillet | SVF voicecard | v0.4